# Altium schematic sheet Power Supply.SchDoc
size A; SheetNumber: 2; SheetTotal: 10
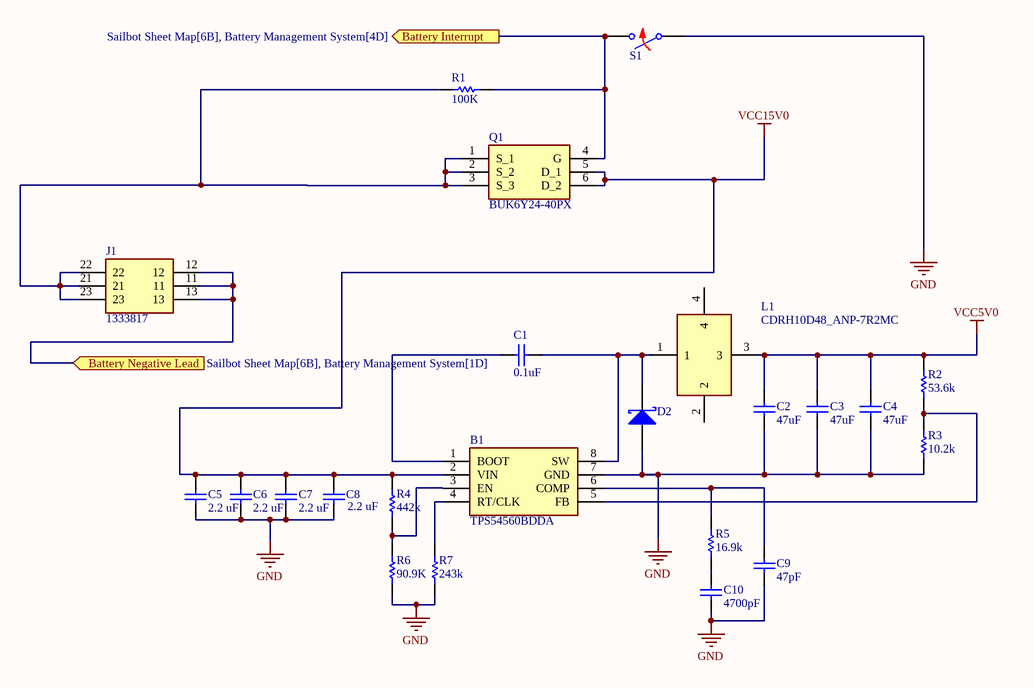
[diagram p0: Power Supply.SchDoc]

## Parts
B1  TPS54560BDDA  [SOIC127P600X170-8N]
C1  value 0.1uF  [C0805]  (hidden comment: Capacitor)
C2  value 47uF  [C0805]  (hidden comment: Capacitor)
C3  value 47uF  [C0805]  (hidden comment: Capacitor)
C4  value 47uF  [C0805]  (hidden comment: Capacitor)
C5  value 2.2 uF  [C0805]  (hidden comment: Capacitor)
C6  value 2.2 uF  [C0805]  (hidden comment: Capacitor)
C7  value 2.2 uF  [C0805]  (hidden comment: Capacitor)
C8  value 2.2 uF  [C0805]  (hidden comment: Capacitor)
C9  value 47pF  [C0805]  (hidden comment: Capacitor)
C10  value 4700pF  [C0805]  (hidden comment: Capacitor)
D2  Shottky Diode  [DIOM7959X250N]  (value not drawn)
J1  1333817  [1333817]
L1  CDRH10D48_ANP-7R2MC  [CDRH10D48ANP7R2MC]
Q1  BUK6Y24-40PX  [BUK6Y2440PX]
R1  value 100K  [6-0805_M]  (hidden comment: Resistor)
R2  value 53.6k  [6-0805_M]  (hidden comment: Resistor)
R3  value 10.2k  [6-0805_M]  (hidden comment: Resistor)
R4  value 442k  [6-0805_M]  (hidden comment: Resistor)
R5  value 16.9k  [6-0805_M]  (hidden comment: Resistor)
R6  value 90.9K  [6-0805_M]  (hidden comment: Resistor)
R7  value 243k  [6-0805_M]  (hidden comment: Resistor)
S1  Switch Normally Opened  (value not drawn)

## Ports
Battery Interrupt (out, see Sailbot Sheet Map[6B], Battery Management System[4D]), Battery Negative Lead (in, see Sailbot Sheet Map[6B], Battery Management System[1D])

## Nets
GND: B1.7(GND) C2.1 C3.1 C4.1 C5.1 C6.1 C7.1 C8.1 C9.1 C10.1 D2.1(A) R3.1 R6.1 R7.1 S1.1
VCC5V0: C2.2 C3.2 C4.2 L1.3 R2.2
VCC15V0: B1.2(VIN) C5.2 C6.2 C7.2 C8.2 Q1.5(D_1) Q1.6(D_2) R4.2
Battery Interrupt: Q1.4(G) R1.2 S1.2 ; port Battery Interrupt
Battery Negative Lead: J1.11 J1.12 J1.13 ; port Battery Negative Lead
NetB1_1: B1.1(BOOT) C1.1
NetB1_3: B1.3(EN) R4.1 R6.2
NetB1_4: B1.4(RT/CLK) R7.2
NetB1_5: B1.5(FB) R2.1 R3.2
NetB1_6: B1.6(COMP) C9.2 R5.2
NetB1_8: B1.8(SW) C1.2 D2.2(K) L1.1
NetC10_2: C10.2 R5.1
NetJ1_21: J1.21 J1.22 J1.23 Q1.1(S_1) Q1.2(S_2) Q1.3(S_3) R1.1

Not connected (* = marked no-connect by the designer): L1 2 4

## Library data of the parts
B1 = TPS54560BDDA: Switching Voltage Regulators A 595-TPS54560BDDAR; Manufacturer_Name: Texas Instruments; Geometry.Height: 1.7mm; Mouser Part Number: 595-TPS54560BDDA; Mouser Price/Stock: https://www.mouser.co.uk/ProductDetail/Texas-Instruments/TPS54560BDDA?qs=gZXFycFWdAMqSdZZ7nACGQ%3D%3D; Manufacturer_Part_Number: TPS54560BDDA; Datasheet Link: http://www.ti.com/lit/ds/symlink/tps54560b.pdf
C1-C10 = Capacitor: SimulationGenericComponent: True
D2 = Shottky Diode: AF: 1; BV: 0; BV_MAX: 1e99; EG: 1.11; FC: 0.5; IBV: 0.001; IS: 1e-14; MJSW: 0.33; NTUN: 30; TNOM: 27; XTI: 3; SimulationGenericComponent: True; CJO: 0; CJP: 0; CTA: 0; CTP: 0; FCS: 0.5; FV_MAX: 1e99; IKF: 0; IKR: 0; ISR: 1e-14; JSW: 0; JTUN: 0; JTUNSW: 0; KEG: 1; KF: 0; LEVEL: 1; N: 1; NBV: 1; NR: 1; NS: 1; PHP: 1; RS: 0; TCV: 0; TLEV: 0; TLEVC: 0; TM1: 0; TM2: 0; TPB: 0; TPHP: 0; TRS: 0; TRS2: 0; TT: 0; TTT1: 0; TTT2: 0; VJ: 1; XTITUN: 3
J1 = 1333817: Pluggable Terminal Blocks LPTA 16/ 2-10,0-ZB; Manufacturer_Name: Phoenix Contact; Geometry.Height: 46.4mm; Mouser Part Number: 651-1333817; Mouser Price/Stock: https://www.mouser.co.uk/ProductDetail/Phoenix-Contact/1333817?qs=Jm2GQyTW%2Fbi%252BbQzIAqu7ww%3D%3D; Manufacturer_Part_Number: 1333817; Datasheet Link: https://www.phoenixcontact.com/en-pc/products/pcb-terminal-block-lpta-16-2-100-zb-1333817
L1 = CDRH10D48_ANP-7R2MC: Fixed Inductors SMD Power Inductor; Manufacturer_Name: Sumida; Manufacturer_Part_Number: CDRH10D48/ANP-7R2MC; Geometry.Height: 5mm; Mouser Part Number: 851-CDRH10D48/ANP7R2; Mouser Price/Stock: https://www.mouser.co.uk/ProductDetail/Sumida/CDRH10D48-ANP-7R2MC?qs=mT6umqgwvA2FCldKZoKGVw%3D%3D; Datasheet Link: https://datasheet.datasheetarchive.com/originals/distributors/Datasheets-DGA11/2227373.pdf
Q1 = BUK6Y24-40PX: NEXPERIA - BUK6Y24-40PX - Power MOSFET, P Channel, 40 V, 39 A, 0.019 ohm, LFPAK56, Surface Mount; Geometry.Height: 1.2mm; Mouser Part Number: 771-BUK6Y24-40PX; Mouser Price/Stock: https://www.mouser.co.uk/ProductDetail/Nexperia/BUK6Y24-40PX?qs=vmHwEFxEFR8tyd2WwTEwBg%3D%3D; Manufacturer_Name: Nexperia; Manufacturer_Part_Number: BUK6Y24-40PX; Datasheet Link: https://assets.nexperia.com/documents/data-sheet/BUK6Y24-40P.pdf
R1-R7 = Resistor: TC1: 0; SimulationGenericComponent: True; TC2: 0
S1 = SW NO: closed: 0; Rclosed: 1m; Ropen: 1Meg; SimulationGenericComponent: True